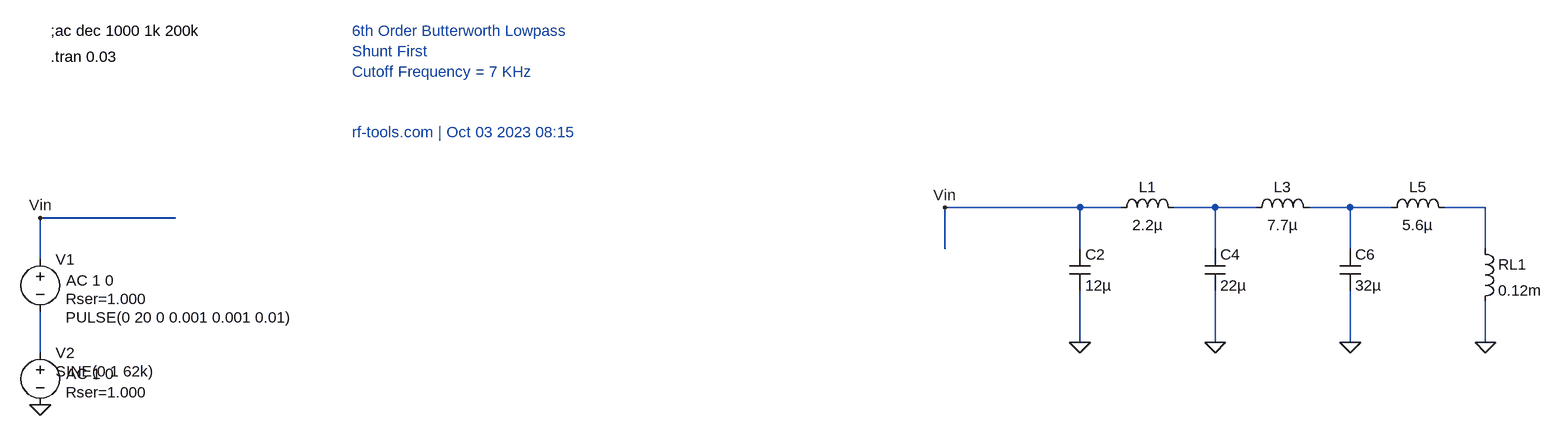
[diagram p0: schematic filter2.asc]
filter2.asc, the LTspice schematic file:
Version 4
SHEET 1 2320 400
WIRE 1600 -16 1392 -16
WIRE 1664 -16 1600 -16
WIRE 1808 -16 1744 -16
WIRE 1872 -16 1808 -16
WIRE 2016 -16 1952 -16
WIRE 2080 -16 2016 -16
WIRE 2224 -16 2160 -16
WIRE 208 0 0 0
WIRE 1392 48 1392 -16
WIRE 1600 48 1600 -16
WIRE 1808 48 1808 -16
WIRE 2016 48 2016 -16
WIRE 2224 48 2224 -16
WIRE 0 64 0 0
WIRE 1600 192 1600 112
WIRE 1808 192 1808 112
WIRE 2016 192 2016 112
WIRE 2224 192 2224 128
WIRE 0 208 0 144
FLAG 0 288 0
FLAG 0 0 Vin
FLAG 1600 192 0
FLAG 1808 192 0
FLAG 2016 192 0
FLAG 2224 192 0
FLAG 1392 -16 Vin
SYMBOL voltage 0 48 R0
WINDOW 123 40 48 Left 2
WINDOW 39 39 77 Left 2
WINDOW 3 39 105 Left 2
SYMATTR Value2 AC 1 0
SYMATTR SpiceLine Rser=1.000
SYMATTR Value PULSE(0 20 0 0.001 0.001 0.01)
SYMATTR InstName V1
SYMBOL voltage 0 192 R0
WINDOW 123 40 48 Left 2
WINDOW 39 39 77 Left 2
WINDOW 3 24 44 Left 2
SYMATTR Value2 AC 1 0
SYMATTR SpiceLine Rser=1.000
SYMATTR Value SINE(0 1 62k)
SYMATTR InstName V2
SYMBOL cap 1584 48 R0
SYMATTR InstName C2
SYMATTR Value 12µ
SYMBOL ind 1648 0 R270
WINDOW 0 32 56 VTop 2
WINDOW 3 5 56 VBottom 2
SYMATTR InstName L1
SYMATTR Value 2.2µ
SYMBOL cap 1792 48 R0
SYMATTR InstName C4
SYMATTR Value 22µ
SYMBOL ind 1856 0 R270
WINDOW 0 32 56 VTop 2
WINDOW 3 5 56 VBottom 2
SYMATTR InstName L3
SYMATTR Value 7.7µ
SYMBOL cap 2000 48 R0
SYMATTR InstName C6
SYMATTR Value 32µ
SYMBOL ind 2064 0 R270
WINDOW 0 32 56 VTop 2
WINDOW 3 5 56 VBottom 2
SYMATTR InstName L5
SYMATTR Value 5.6µ
SYMBOL ind 2208 32 R0
SYMATTR InstName RL1
SYMATTR Value 0.12m
SYMATTR SpiceLine Rser=0.2
TEXT 16 -288 Left 2 !;ac dec 1000 1k 200k
TEXT 480 -288 Left 2 ;6th Order Butterworth Lowpass\nShunt First\nCutoff Frequency = 7 KHz\n\n\nrf-tools.com | Oct 03 2023 08:15
TEXT 16 -248 Left 2 !.tran 0.03

The netlist it stands for:
* filter2.asc
V1 Vin N004 PULSE(0 20 0 0.001 0.001 0.01) AC 1 0 Rser=1.000
V2 N004 0 SINE(0 1 62k) AC 1 0 Rser=1.000
C2 Vin 0 12µ
L1 Vin N001 2.2µ
C4 N001 0 22µ
L3 N001 N002 7.7µ
C6 N002 0 32µ
L5 N002 N003 5.6µ
L§RL1 N003 0 0.12m Rser=0.2
;ac dec 1000 1k 200k
* 6th Order Butterworth Lowpass
* Shunt First
* Cutoff Frequency = 7 KHz
* rf-tools.com | Oct 03 2023 08:15
.tran 0.03
.backanno
.end